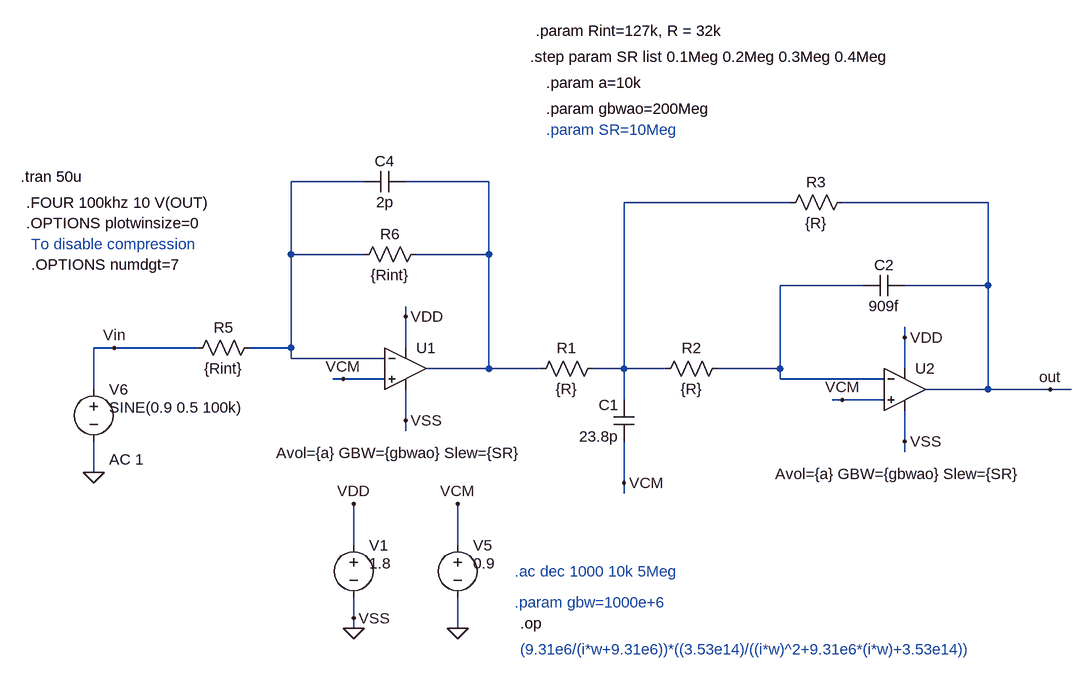
[diagram p0: schematic FTJ_ord3_Rauch_AOmodel_EfectSR.asc]
FTJ_ord3_Rauch_AOmodel_EfectSR.asc, the LTspice schematic file:
Version 4
SHEET 1 4436 1708
WIRE 3280 -144 3168 -144
WIRE 3472 -144 3344 -144
WIRE 3936 -112 3680 -112
WIRE 4240 -112 4016 -112
WIRE 3168 -32 3168 -144
WIRE 3280 -32 3168 -32
WIRE 3472 -32 3472 -144
WIRE 3472 -32 3360 -32
WIRE 4048 16 3920 16
WIRE 4240 16 4240 -112
WIRE 4240 16 4112 16
WIRE 3344 64 3344 48
WIRE 4112 96 4112 80
WIRE 2896 112 2864 112
WIRE 3024 112 2896 112
WIRE 3168 112 3168 -32
WIRE 3168 112 3104 112
WIRE 3344 112 3344 64
WIRE 3168 128 3168 112
WIRE 3312 128 3168 128
WIRE 3472 144 3472 -32
WIRE 3472 144 3376 144
WIRE 3552 144 3472 144
WIRE 3680 144 3680 -112
WIRE 3680 144 3632 144
WIRE 3744 144 3680 144
WIRE 3920 144 3920 16
WIRE 3920 144 3824 144
WIRE 4112 144 4112 96
WIRE 3248 160 3232 160
WIRE 3312 160 3248 160
WIRE 3920 160 3920 144
WIRE 4080 160 3920 160
WIRE 2864 176 2864 112
WIRE 4240 176 4240 16
WIRE 4240 176 4144 176
WIRE 4336 176 4240 176
WIRE 4368 176 4336 176
WIRE 3680 192 3680 144
WIRE 4016 192 4000 192
WIRE 4080 192 4016 192
WIRE 3344 224 3344 176
WIRE 3344 240 3344 224
WIRE 4112 256 4112 208
WIRE 4112 272 4112 256
WIRE 2864 304 2864 256
WIRE 3680 320 3680 256
WIRE 3680 336 3680 320
WIRE 3264 416 3264 352
WIRE 3424 416 3424 352
WIRE 3264 528 3264 496
WIRE 3264 544 3264 528
WIRE 3424 544 3424 496
FLAG 4336 176 out
FLAG 3680 320 VCM
FLAG 3264 544 0
FLAG 3424 544 0
FLAG 3264 352 VDD
FLAG 3424 352 VCM
FLAG 3264 528 VSS
FLAG 3344 224 VSS
FLAG 3344 64 VDD
FLAG 3248 160 VCM
FLAG 2864 304 0
FLAG 2896 112 Vin
FLAG 4112 256 VSS
FLAG 4112 96 VDD
FLAG 4016 192 VCM
DATAFLAG 3472 -96 ""
SYMBOL cap 4112 0 R90
WINDOW 0 0 32 VBottom 2
WINDOW 3 32 32 VTop 2
SYMATTR InstName C2
SYMATTR Value 909f
SYMBOL res 3648 128 R90
WINDOW 0 0 56 VBottom 2
WINDOW 3 32 56 VTop 2
SYMATTR InstName R1
SYMATTR Value {R}
SYMBOL res 3840 128 R90
WINDOW 0 0 56 VBottom 2
WINDOW 3 32 56 VTop 2
SYMATTR InstName R2
SYMATTR Value {R}
SYMBOL cap 3696 256 R180
WINDOW 0 24 56 Left 2
WINDOW 3 24 8 Left 2
SYMATTR InstName C1
SYMATTR Value 23.8p
SYMBOL res 4032 -128 R90
WINDOW 0 0 56 VBottom 2
WINDOW 3 32 56 VTop 2
SYMATTR InstName R3
SYMATTR Value {R}
SYMBOL voltage 3264 400 R0
WINDOW 123 24 124 Left 2
WINDOW 39 0 0 Left 2
WINDOW 3 24 44 Left 2
SYMATTR Value 1.8
SYMATTR InstName V1
SYMBOL voltage 3424 400 R0
WINDOW 123 24 124 Left 2
WINDOW 39 0 0 Left 2
WINDOW 3 24 44 Left 2
SYMATTR Value 0.9
SYMATTR InstName V5
SYMBOL res 3120 96 R90
WINDOW 0 0 56 VBottom 2
WINDOW 3 32 56 VTop 2
SYMATTR InstName R5
SYMATTR Value {Rint}
SYMBOL cap 3344 -160 R90
WINDOW 0 0 32 VBottom 2
WINDOW 3 32 32 VTop 2
SYMATTR InstName C4
SYMATTR Value 2p
SYMBOL res 3376 -48 R90
WINDOW 0 0 56 VBottom 2
WINDOW 3 32 56 VTop 2
SYMATTR InstName R6
SYMATTR Value {Rint}
SYMBOL Opamps\\UniversalOpamp2 3344 144 R0
WINDOW 123 -199 130 Left 2
SYMATTR Value2 Avol={a} GBW={gbwao} Slew={SR}
SYMATTR InstName U1
SYMBOL voltage 2864 160 R0
WINDOW 123 24 124 Left 2
WINDOW 39 0 0 Left 2
WINDOW 3 24 44 Left 2
SYMATTR Value2 AC 1
SYMATTR Value SINE(0.9 0.5 100k)
SYMATTR InstName V6
SYMBOL Opamps\\UniversalOpamp2 4112 176 R0
WINDOW 123 -199 130 Left 2
SYMATTR Value2 Avol={a} GBW={gbwao} Slew={SR}
SYMATTR InstName U2
TEXT 3512 456 Left 2 ;.ac dec 1000 10k 5Meg
TEXT 3512 504 Left 2 ;.param gbw=1000e+6
TEXT 3520 536 Left 2 !.op
TEXT 3520 576 Left 2 ;(9.31e6/(i*w+9.31e6))*((3.53e14)/((i*w)^2+9.31e6*(i*w)+3.53e14))
TEXT 3544 -376 Left 2 !.param Rint=127k, R = 32k
TEXT 2752 -152 Left 2 !.tran 50u
TEXT 3560 -296 Left 2 !.param a=10k
TEXT 3560 -256 Left 2 !.param gbwao=200Meg
TEXT 3560 -224 Left 2 ;.param SR=10Meg
TEXT 2760 -112 Left 2 !.FOUR 100khz 10 V(OUT)
TEXT 2760 -80 Left 2 !.OPTIONS plotwinsize=0
TEXT 2768 -48 Left 2 ;To disable compression
TEXT 2768 -16 Left 2 !.OPTIONS numdgt=7
TEXT 3536 -336 Left 2 !.step param SR list 0.1Meg 0.2Meg 0.3Meg 0.4Meg

The netlist it stands for:
* FTJ_ord3_Rauch_AOmodel_EfectSR.asc
C2 out N004 909f
R1 N003 N002 {R}
R2 N004 N003 {R}
C1 VCM N003 23.8p
R3 out N003 {R}
V1 VDD 0 1.8
V5 VCM 0 0.9
R5 N001 Vin {Rint}
C4 N002 N001 2p
R6 N002 N001 {Rint}
XU1 VCM N001 VDD 0 N002 level.2 Avol={a} GBW={gbwao} Slew={SR} ilimit=25m rail=0 Vos=0 phimargin=45 en=0 enk=0 in=0 ink=0 Rin=500Meg  ; pins IN+ IN- V+ V- OUT
V6 Vin 0 SINE(0.9 0.5 100k) AC 1
XU2 VCM N004 VDD 0 out level.2 Avol={a} GBW={gbwao} Slew={SR} ilimit=25m rail=0 Vos=0 phimargin=45 en=0 enk=0 in=0 ink=0 Rin=500Meg  ; pins IN+ IN- V+ V- OUT
* .ac dec 1000 10k 5Meg
* .param gbw=1000e+6
.op
* (9.31e6/(i*w+9.31e6))*((3.53e14)/((i*w)^2+9.31e6*(i*w)+3.53e14))
.param Rint=127k, R = 32k
.tran 50u
.param a=10k
.param gbwao=200Meg
* .param SR=10Meg
.FOUR 100khz 10 V(OUT)
.OPTIONS plotwinsize=0
* To disable compression
.OPTIONS numdgt=7
.step param SR list 0.1Meg 0.2Meg 0.3Meg 0.4Meg
.lib UniversalOpamps2.sub
.backanno
.end